# EAGLE design Sensor_Cameralink (EAGLE 9.6.2)
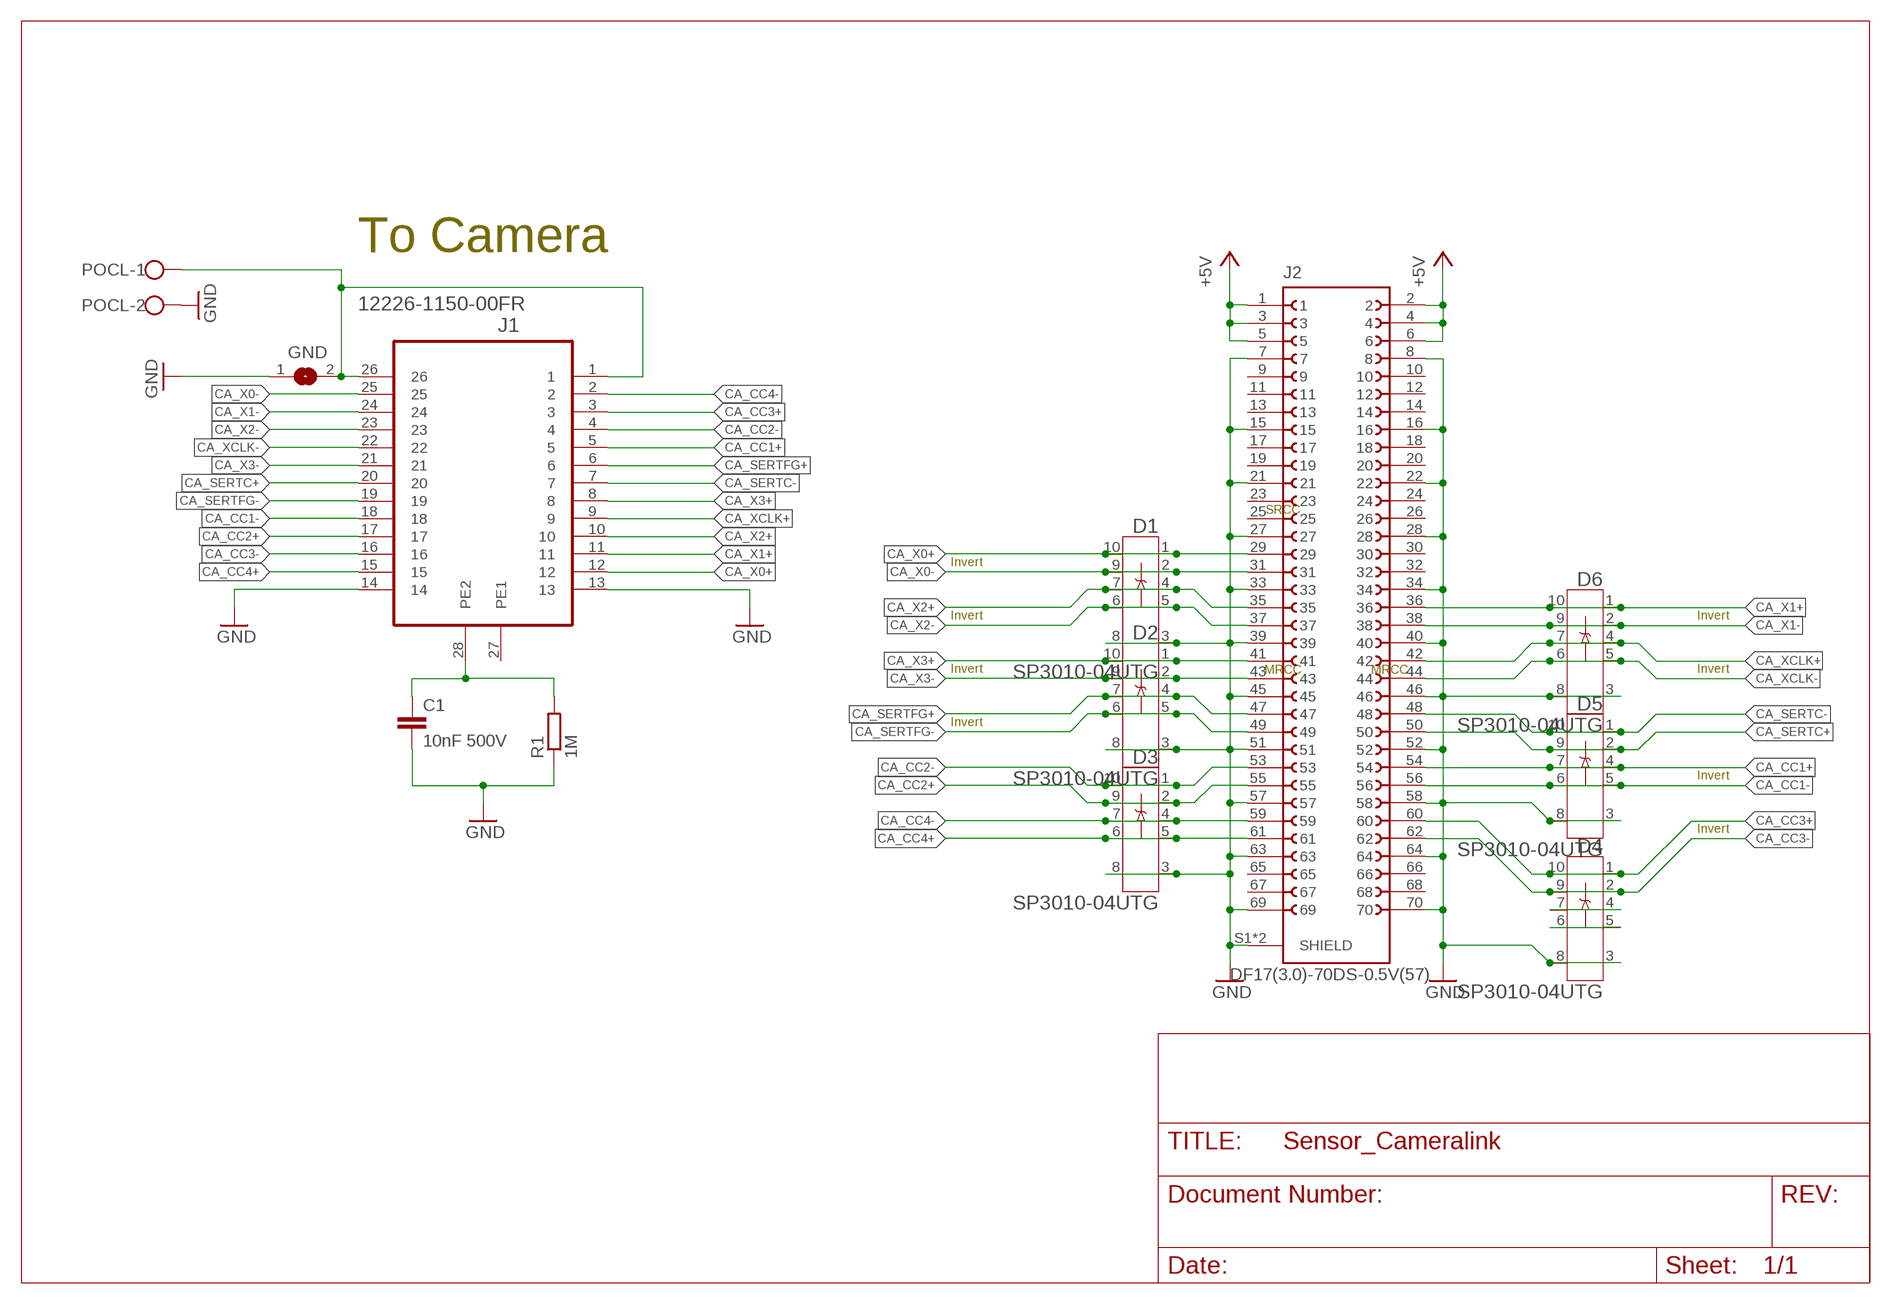
[diagram p0: schematic, sheet 1]

## Parts
C1  10nF 500V  C-EUC0805  [C0805]
D1  SP3010-04UTG  [UDFEN-10_MO229_LTF]
D2  SP3010-04UTG  [UDFEN-10_MO229_LTF]
D3  SP3010-04UTG  [UDFEN-10_MO229_LTF]
D4  SP3010-04UTG  [UDFEN-10_MO229_LTF]
D5  SP3010-04UTG  [UDFEN-10_MO229_LTF]
D6  SP3010-04UTG  [UDFEN-10_MO229_LTF]
GND  SJ  [SJ]
J1  12226-1150-00FR  [3M_12226-1150-00FR]
J2  DF17(3.0)-70DS-0.5V(57)  [DF17(3.0)-70DS-0.5V(57)]
POCL  W237-102  [W237-102]
R1  1M  R-EU_R0805  [R0805]

## Nets
+5V: J2.1 J2.2 J2.3 J2.4 J2.5 J2.6
CA_CC1+: D5.4 D5.7 J1.5 J2.54
CA_CC1-: D5.5 D5.6 J1.18 J2.56
CA_CC2+: D3.2 D3.9 J1.17 J2.55
CA_CC2-: D3.1 D3.10 J1.4 J2.53
CA_CC3+: D4.1 D4.10 J1.3 J2.60
CA_CC3-: D4.2 D4.9 J1.16 J2.62
CA_CC4+: D3.5 D3.6 J1.15 J2.61
CA_CC4-: D3.4 D3.7 J1.2 J2.59
CA_SERTC+: D5.2 D5.9 J1.20 J2.50
CA_SERTC-: D5.1 D5.10 J1.7 J2.48
CA_SERTFG+: D2.4 D2.7 J1.6 J2.47
CA_SERTFG-: D2.5 D2.6 J1.19 J2.49
CA_X0+: D1.1 D1.10 J1.12 J2.29
CA_X0-: D1.2 D1.9 J1.25 J2.31
CA_X1+: D6.1 D6.10 J1.11 J2.36
CA_X1-: D6.2 D6.9 J1.24 J2.38
CA_X2+: D1.4 D1.7 J1.10 J2.35
CA_X2-: D1.5 D1.6 J1.23 J2.37
CA_X3+: D2.1 D2.10 J1.8 J2.41
CA_X3-: D2.2 D2.9 J1.21 J2.43
CA_XCLK+: D6.4 D6.7 J1.9 J2.42
CA_XCLK-: D6.5 D6.6 J1.22 J2.44
GND: C1.2 D1.3 D1.8 D2.3 D2.8 D3.3 D3.8 D4.3 D4.8 D5.3 D5.8 D6.3 D6.8 GND.1 J1.13 J1.14 J2.7 J2.8 J2.15 J2.16 J2.21 J2.22 J2.27 J2.28 J2.33 J2.34 J2.39 J2.40 J2.45 J2.46 J2.51 J2.52 J2.57 J2.58 J2.63 J2.64 J2.69 J2.70 J2.S1(SHIELD) J2.S2(SHIELD) POCL.2 R1.1
N$00001: D4.4 D4.7
N$00002: D4.5 D4.6
N$00005: C1.1 J1.28(PE2) R1.2
N$00011: GND.2 J1.1 J1.26 POCL.1
Unconnected: J1.27(PE1) J2.9 J2.10 J2.11 J2.12 J2.13 J2.14 J2.17 J2.18 J2.19 J2.20 J2.23 J2.24 J2.25 J2.26 J2.30 J2.32 J2.65 J2.66 J2.67 J2.68

## Notes on the sheet
- To Camera
- SRCC
- Invert
- Invert | Invert
- Invert | MRCC | MRCC | Invert
- Invert
- Invert
- Invert

## Library data of the parts
C1 = rcl:C-EU: CAPACITOR, European symbol; BUERKLIN: 56D510; LAGERORT: 67/01; MBM: 1; PREIS: 0,13
D1-D6 = onsemi:SP3010-04UTG; LCSC: C126837; MANUFACTURER_NAME: Littelfuse Inc; MPN: SP3010-04UTG
GND = jumper:SJ: SMD solder JUMPER
J1 = mh_fpga_anschlussplatine_v2:12226-1150-00FR: CONN SDR 26POS VERT RECEPT; FARNELL: 1321037; MBM: 1; PREIS: 10,08
J2 = Hirose:DF17(3.0)-70DS-0.5V(57)
POCL = con-wago-500:W237-102: WAGO SCREW CLAMP; MPN: 237-102; OC_FARNELL: unknown; OC_NEWARK: 70K9898
R1 = resistor:R-EU_: RESISTOR, European symbol; BUERKLIN: 11E338; MBM: 10; PREIS: 0,04

## Board
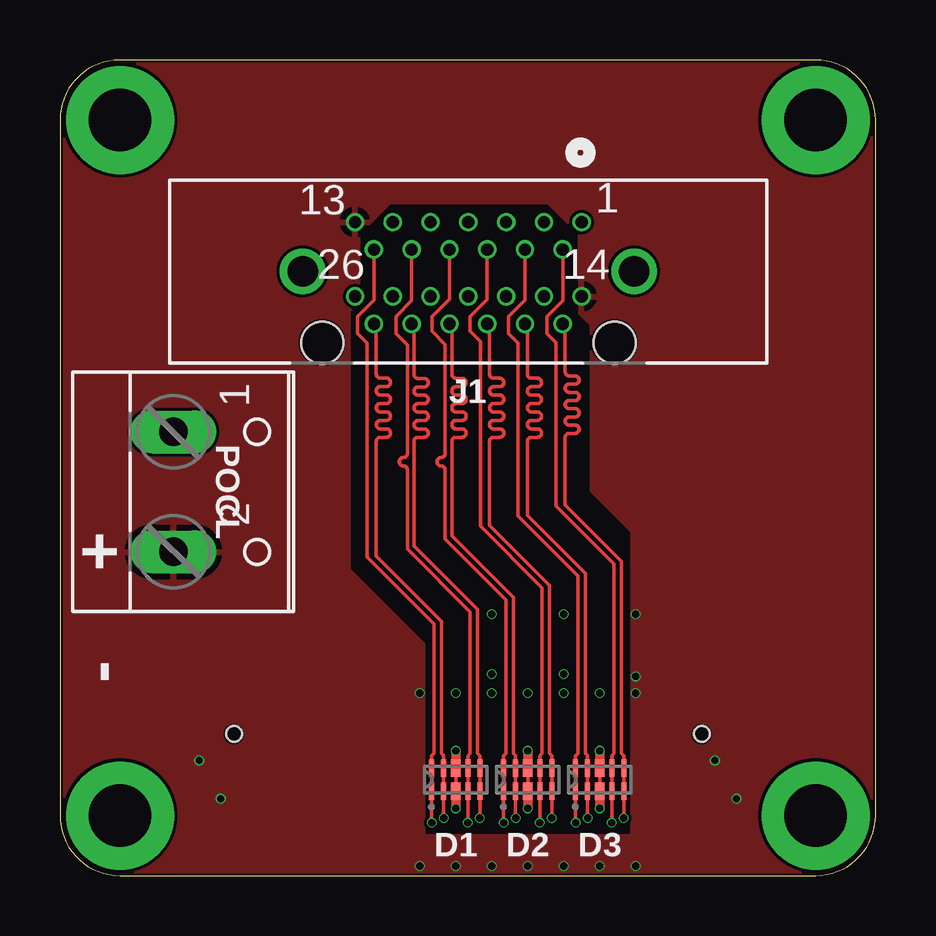
[diagram p1: board, top side]
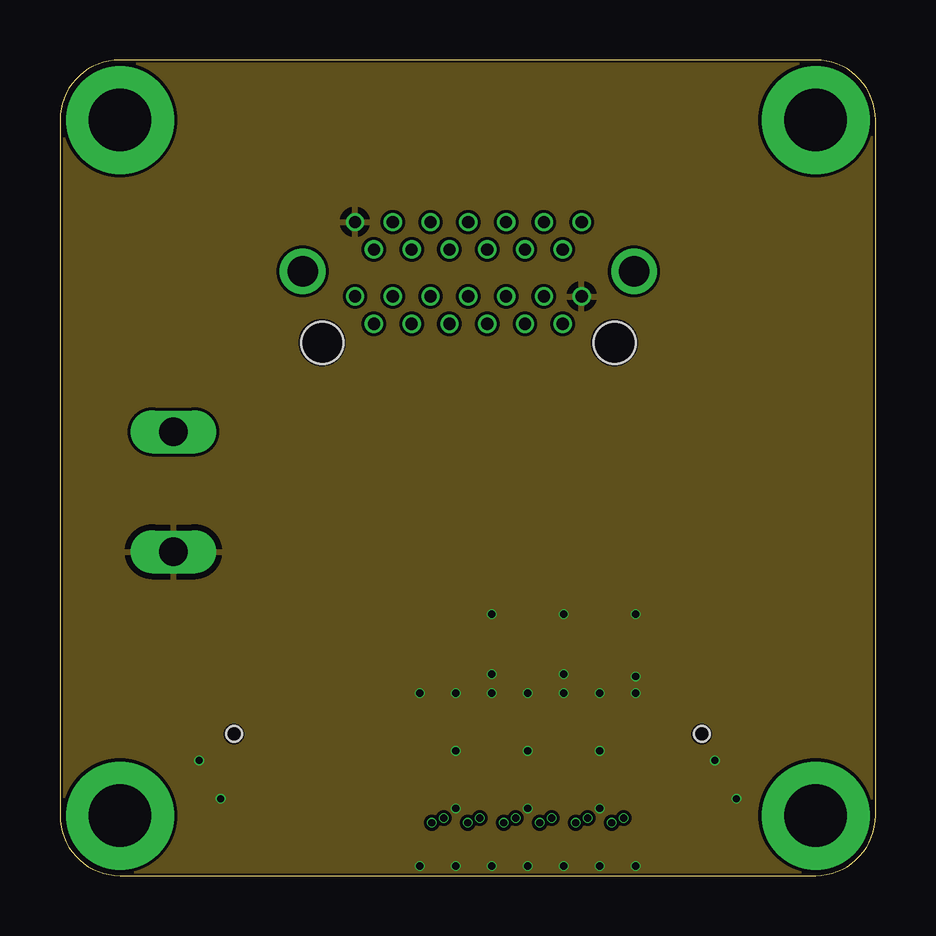
[diagram p2: board, inner layer Route2]
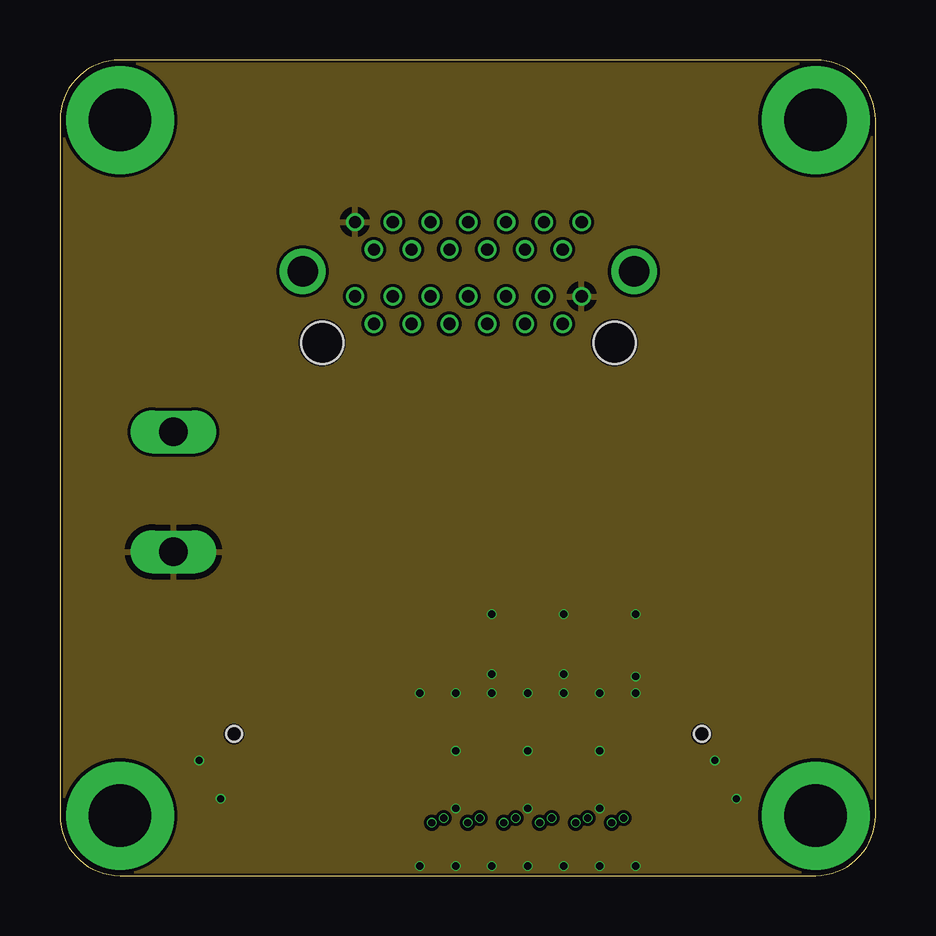
[diagram p3: board, inner layer Route15]
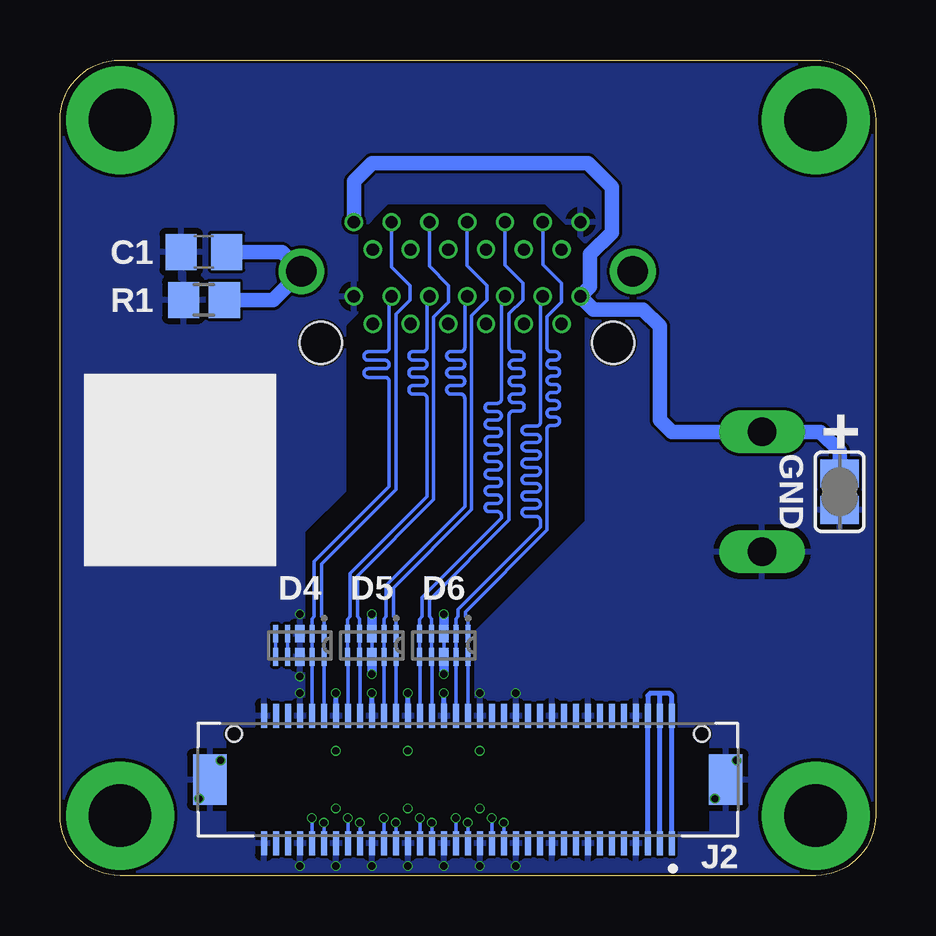
[diagram p4: board, bottom side, seen from below]

Size 34 x 34 mm. Coordinates in mm from the lower left corner, seen from the top.
Outline: 0,31.5 0,2.5 arc90 2.5,0 31.5,0 arc90 34,2.5 34,31.5 arc90 31.5,34 2.5,34 arc90 0,31.5
Copper layers (1*2*15*16): Top 0.035559375mm / dielectric 0.17018125mm / Route2 0.01778125mm / dielectric 47mil / Route15 0.01778125mm / dielectric 0.17018125mm / Bottom 0.035559375mm
Design rules "jlcpcb-4-layer *": minimum track width 5mil, minimum drill 0.2mm, track to track 5mil, track to pad 5mil, pad to pad 5mil, via to via 5mil, smd to smd 0mil, copper to edge 0.1mm, drill to drill 5mil, minimum pad ring 0.1mm, minimum via ring 0.05mm, stop-mask expansion 3mil, vias tented up to drill 100mil, thermal gap 10mil

### Footprints (pad centres in the part's own frame; a part is rotated, then mirrored left to right if it is on the bottom)
C0805 = smd 1.3 x 1.5: 1 -0.95,0; 2 0.95,0
UDFEN-10_MO229_LTF = smd 0.737 x 0.203: 1 -0.483,1.016; 2 -0.483,0.508; 4 -0.483,-0.508; 5 -0.483,-1.016; 6 0.483,-1.016; 7 0.483,-0.508; 9 0.483,0.508; 10 0.483,1.016 | smd 0.737 x 0.406: 3 -0.483,0; 8 0.483,0
SJ = smd 1.168 x 1.6: 1 -0.762,0; 2 0.762,0
3M_12226-1150-00FR = drill 0.508: 1 9.449,4.242; 2 8.661,3.099; 3 7.874,4.242; 4 7.087,3.099; 5 6.299,4.242; 6 5.512,3.099; 7 4.724,4.242; 8 3.937,3.099; 9 3.15,4.242; 10 2.362,3.099; 11 1.575,4.242; 12 0.787,3.099; 13 0,4.242; 14 9.449,1.143; 15 8.661,0; 16 7.874,1.143; 17 7.087,0; 18 6.299,1.143; 19 5.512,0; 20 4.724,1.143; 21 3.937,0; 22 3.15,1.143; 23 2.362,0; 24 1.575,1.143; 25 0.787,0; 26 0,1.143 | drill 1.27: 27 -2.184,2.184; 28 11.633,2.184 | hole 1.753: -1.372,-0.787; 10.82,-0.787
DF17(3.0)-70DS-0.5V(57) = smd 0.25 x 1: 1 -8.5,2.65; 2 -8.5,-2.65; 3 -8,2.65; 4 -8,-2.65; 5 -7.5,2.65; 6 -7.5,-2.65; 7 -7,2.65; 8 -7,-2.65; 9 -6.5,2.65; 10 -6.5,-2.65; 11 -6,2.65; 12 -6,-2.65; 13 -5.5,2.65; 14 -5.5,-2.65; 15 -5,2.65; 16 -5,-2.65; 17 -4.5,2.65; 18 -4.5,-2.65; 19 -4,2.65; 20 -4,-2.65; 21 -3.5,2.65; 22 -3.5,-2.65; 23 -3,2.65; 24 -3,-2.65; 25 -2.5,2.65; 26 -2.5,-2.65; 27 -2,2.65; 28 -2,-2.65; 29 -1.5,2.65; 30 -1.5,-2.65; 31 -1,2.65; 32 -1,-2.65; 33 -0.5,2.65; 34 -0.5,-2.65; 35 0,2.65; 36 0,-2.65; 37 0.5,2.65; 38 0.5,-2.65; 39 1,2.65; 40 1,-2.65; 41 1.5,2.65; 42 1.5,-2.65; 43 2,2.65; 44 2,-2.65; 45 2.5,2.65; 46 2.5,-2.65; 47 3,2.65; 48 3,-2.65; 49 3.5,2.65; 50 3.5,-2.65; 51 4,2.65; 52 4,-2.65; 53 4.5,2.65; 54 4.5,-2.65; 55 5,2.65; 56 5,-2.65; 57 5.5,2.65; 58 5.5,-2.65; 59 6,2.65; 60 6,-2.65; 61 6.5,2.65; 62 6.5,-2.65; 63 7,2.65; 64 7,-2.65; 65 7.5,2.65; 66 7.5,-2.65; 67 8,2.65; 68 8,-2.65; 69 8.5,2.65; 70 8.5,-2.65 | smd 1.4 x 2.1: S1 -10.75,0; S2 10.75,0 | hole 0.65: -9.75,-1.9; 9.75,-1.9
W237-102 = drill 1.194 long: 1 -2.5,-1.27; 2 2.5,-1.27
R0805 = smd 1.3 x 1.5: 1 -0.85,0; 2 0.85,0

### Placement (x,y rotation side)
C1  28,26 180 bottom
D1  16.5,4 90 top
D2  19.5,4 90 top
D3  22.5,4 90 top
D4  24,9.6 270 bottom
D5  21,9.6 270 bottom
D6  18,9.6 270 bottom
GND  1.5,16 90 bottom
J1  12.3,23 0 top
J2  17,4 180 bottom
POCL  6,16 270 top
R1  28,24 0 bottom

### Tracks (layer width: path | path; a pad name or v marks a point on that pad's centre or on a via)
+5V
  Bottom 0.2: J2.1 J2.2 8.5,7.5 8.6,7.6 9,7.6 | J2.3 J2.4 9,7.6 | J2.5 J2.6 9.5,7.5 9.4,7.6 9,7.6
CA_CC1+
  Bottom 0.15: J1.5 18.6,25.4 17.8,24.6 17.8,23.9 18.42,23.28 18.42,15.68 21.6,12.5 21.6,10.8 21.51,10.71 D5.4 | J2.54 D5.7
  Bottom 0.152: D5.4 D5.7
CA_CC1-
  Bottom 0.15: J1.18 18.7,24.04 18.7,22.01 arc90 18.87,21.84 19.28,21.84 arc-90 19.45,21.67 19.45,21.66 arc-90 19.28,21.49 18.87,21.49 arc90 18.7,21.32 18.7,21.3 arc90 18.87,21.13 19.28,21.13 arc-90 19.45,20.96 19.45,20.95 arc-90 19.28,20.78 18.87,20.78 arc90 18.7,20.61 18.7,20.59 arc90 18.87,20.43 19.28,20.43 arc-90 19.45,20.25 19.45,20.24 arc-90 19.28,20.07 18.87,20.07 arc90 18.7,19.9 18.7,15.8 21.9,12.6 21.9,10.8 22.02,10.68 D5.5 | J2.56 22,9.1 D5.6
  Bottom 0.152: D5.5 D5.6
CA_CC2+  (via drill 0.3)
  Top 0.15: J1.17 19.49,22.9 19.49,20.9 arc90 19.66,20.73 19.91,20.73 arc-90 20.08,20.56 20.08,20.55 arc-90 19.91,20.38 19.66,20.38 arc90 19.49,20.21 19.49,20.2 arc90 19.66,20.03 19.91,20.03 arc-90 20.08,19.86 20.08,19.85 arc-90 19.91,19.68 19.66,19.68 arc90 19.49,19.51 19.49,19.5 arc90 19.66,19.32 19.91,19.32 arc-90 20.08,19.15 20.08,19.14 arc-90 19.91,18.97 19.66,18.97 arc90 19.49,18.8 19.49,18.79 arc90 19.66,18.62 19.91,18.62 arc-90 20.08,18.45 20.08,18.44 arc-90 19.91,18.27 19.66,18.27 arc90 19.49,18.1 19.49,15.01 21.9,12.6 21.9,5.1 21.99,5.01 D3.9 | D3.2 v21.99,2.41 v22,2.4
  Top 0.152: D3.2 D3.9
  Bottom 0.15: J2.55 v22,2.4
CA_CC2-  (via drill 0.3)
  Top 0.15: J1.4 19.39,23.99 18.7,23.3 18.7,22.6 19.1,22.2 19.1,15 21.6,12.5 21.6,5.1 21.48,4.98 D3.10 | D3.1 21.48,2.22 v21.5,2.2
  Top 0.152: D3.1 D3.10
  Bottom 0.15: J2.53 v21.5,2.2
CA_CC3+
  Bottom 0.15: J1.3 20.17,25.37 19.4,24.6 19.4,24 20,23.4 20,16.1 23.1,13 23.1,10.8 22.98,10.68 D4.1 | J2.60 23,9.1 D4.10
  Bottom 0.152: D4.1 D4.10
CA_CC3-
  Bottom 0.15: J1.16 20.27,24.04 20.27,22.01 arc90 20.44,21.84 21.15,21.84 arc-90 21.32,21.66 21.32,21.65 arc-90 21.15,21.48 20.44,21.48 arc90 20.27,21.31 20.27,21.3 arc90 20.44,21.12 21.15,21.12 arc-90 21.32,20.95 21.32,20.94 arc-90 21.15,20.77 20.44,20.77 arc90 20.27,20.6 20.27,16.23 23.4,13.1 23.4,10.8 23.49,10.71 D4.2 | J2.62 D4.9
  Bottom 0.152: D4.2 D4.9
CA_CC4+  (via drill 0.3)
  Top 0.15: J1.15 21.06,22.9 21.06,21 arc90 21.23,20.83 21.48,20.83 arc-90 21.65,20.66 21.65,20.66 arc-90 21.48,20.49 21.23,20.49 arc90 21.06,20.32 21.06,20.32 arc90 21.23,20.15 21.48,20.15 arc-90 21.65,19.98 21.65,19.97 arc-90 21.48,19.8 21.23,19.8 arc90 21.06,19.63 21.06,19.63 arc90 21.23,19.46 21.48,19.46 arc-90 21.65,19.29 21.65,19.29 arc-90 21.48,19.12 21.23,19.12 arc90 21.06,18.95 21.06,18.95 arc90 21.23,18.78 21.48,18.78 arc-90 21.65,18.61 21.65,18.61 arc-90 21.48,18.43 21.23,18.43 arc90 21.06,18.27 21.06,15.44 23.4,13.1 23.4,5.1 23.52,4.98 D3.6 | D3.5 23.52,2.42 v23.5,2.4
  Top 0.152: D3.5 D3.6
  Bottom 0.15: J2.61 v23.5,2.4
CA_CC4-  (via drill 0.3)
  Top 0.15: J1.2 20.96,23.96 20.3,23.3 20.3,22.6 20.68,22.22 20.68,15.42 23.1,13 23.1,5.1 23,5 D3.7 | D3.4 v23.01,2.21 v23,2.2
  Top 0.152: D3.4 D3.7
  Bottom 0.15: J2.59 v23,2.2
CA_SERTC+
  Bottom 0.15: J1.20 17.12,24.04 17.12,22.01 arc90 17.3,21.84 17.71,21.84 arc-90 17.88,21.67 17.88,21.66 arc-90 17.71,21.49 17.3,21.49 arc90 17.12,21.32 17.12,21.3 arc90 17.3,21.13 17.71,21.13 arc-90 17.88,20.96 17.88,20.95 arc-90 17.71,20.78 17.3,20.78 arc90 17.12,20.61 17.12,20.59 arc90 17.3,20.43 17.71,20.43 arc-90 17.88,20.25 17.88,20.24 arc-90 17.71,20.07 17.3,20.07 arc90 17.12,19.9 17.12,15.38 20.4,12.1 20.4,10.8 20.49,10.71 D5.2 | J2.50 D5.9
  Bottom 0.152: D5.2 D5.9
CA_SERTC-
  Bottom 0.15: J1.7 17.02,25.42 16.2,24.6 16.2,24 16.85,23.35 16.85,15.25 20.1,12 20.1,10.8 19.98,10.68 D5.1 | J2.48 20,9.1 D5.10
  Bottom 0.152: D5.1 D5.10
CA_SERTFG+  (via drill 0.3)
  Top 0.15: J1.6 17.81,24.01 17.1,23.3 17.1,22.7 17.54,22.27 17.54,14.56 20.1,12 20.1,5.1 20,5 D2.7 | D2.4 v20.01,2.21 v20,2.2
  Top 0.152: D2.4 D2.7
  Bottom 0.15: J2.47 v20,2.2
CA_SERTFG-  (via drill 0.3)
  Top 0.15: J1.19 17.91,22.9 17.91,20.9 arc90 18.08,20.73 18.33,20.73 arc-90 18.5,20.56 18.5,20.55 arc-90 18.33,20.38 18.08,20.38 arc90 17.91,20.21 17.91,20.2 arc90 18.08,20.03 18.33,20.03 arc-90 18.5,19.86 18.5,19.85 arc-90 18.33,19.68 18.08,19.68 arc90 17.91,19.51 17.91,19.5 arc90 18.08,19.32 18.33,19.32 arc-90 18.5,19.15 18.5,19.14 arc-90 18.33,18.97 18.08,18.97 arc90 17.91,18.8 17.91,18.79 arc90 18.08,18.62 18.33,18.62 arc-90 18.5,18.45 18.5,18.44 arc-90 18.33,18.27 18.08,18.27 arc90 17.91,18.1 17.91,14.59 20.4,12.1 20.4,5.1 20.52,4.98 D2.6 | D2.5 20.52,2.42 v20.5,2.4
  Top 0.152: D2.6 D2.5
  Bottom 0.15: J2.49 v20.5,2.4
CA_X0+  (via drill 0.3)
  Top 0.15: J1.12 13.09,23.99 12.4,23.3 12.4,22.6 12.81,22.19 12.81,13.29 15.6,10.5 15.6,5.1 15.48,4.98 D1.10 | D1.1 15.48,2.22 v15.5,2.2
  Top 0.152: D1.1 D1.10
  Bottom 0.15: J2.29 v15.5,2.2
CA_X0-  (via drill 0.3)
  Top 0.15: J1.25 13.19,22.9 13.19,20.91 arc90 13.36,20.74 13.61,20.74 arc-90 13.78,20.57 13.78,20.55 arc-90 13.61,20.38 13.36,20.38 arc90 13.19,20.21 13.19,20.2 arc90 13.36,20.03 13.61,20.03 arc-90 13.78,19.86 13.78,19.85 arc-90 13.61,19.68 13.36,19.68 arc90 13.19,19.51 13.19,19.5 arc90 13.36,19.33 13.61,19.33 arc-90 13.78,19.16 13.78,19.14 arc-90 13.61,18.98 13.36,18.98 arc90 13.19,18.8 13.19,18.79 arc90 13.36,18.62 13.61,18.62 arc-90 13.78,18.45 13.78,18.44 arc-90 13.61,18.27 13.36,18.27 arc90 13.19,18.1 13.19,13.31 15.9,10.6 15.9,5.1 15.99,5.01 D1.9 | D1.2 v15.99,2.41 v16,2.4
  Top 0.152: D1.2 D1.9
  Bottom 0.15: J2.31 v16,2.4
CA_X1+
  Bottom 0.15: J1.11 13.88,25.48 13.1,24.7 13.1,23.9 13.7,23.3 13.7,22.01 arc-90 13.53,21.84 13.34,21.84 arc90 13.17,21.66 | 13.17,21.66 | 13.17,21.66 arc90 13.34,21.5 13.53,21.5 arc-90 13.7,21.32 | 13.7,21.32 | 13.7,21.32 arc-90 13.53,21.16 13.34,21.16 arc90 13.17,20.98 | 13.17,20.98 | 13.17,20.98 arc90 13.34,20.81 13.53,20.81 arc-90 13.7,20.64 | 13.7,20.64 | 13.7,20.64 arc-90 13.53,20.47 13.34,20.47 arc90 13.17,20.3 | 13.17,20.3 | 13.17,20.3 arc90 13.34,20.13 13.53,20.13 arc-90 13.7,19.96 | 13.7,19.96 | 13.7,19.96 arc-90 13.53,19.79 13.34,19.79 arc90 13.17,19.62 | 13.17,19.62 | 13.17,19.62 arc90 13.34,19.45 13.53,19.45 arc-90 13.7,19.28 | 13.7,19.28 | 13.7,19.28 arc-90 13.53,19.11 13.34,19.11 arc90 13.17,18.94 13.17,18.94 arc90 13.34,18.77 13.53,18.77 arc-90 13.7,18.6 13.7,14.4 17.1,11 17.1,10.8 16.98,10.68 D6.1 | D6.10 17,9.1 J2.36
  Bottom 0.152: D6.1 D6.10
CA_X1-
  Bottom 0.15: J1.24 13.97,24.04 13.97,18.9 arc90 14.14,18.73 14.57,18.73 arc-90 14.74,18.56 14.74,18.56 arc-90 14.57,18.39 14.14,18.39 arc90 13.97,18.22 13.97,18.22 arc90 14.14,18.05 14.57,18.05 arc-90 14.74,17.88 14.74,17.87 arc-90 14.57,17.7 14.14,17.7 arc90 13.97,17.53 13.97,17.53 arc90 14.14,17.36 14.57,17.36 arc-90 14.74,17.19 14.74,17.19 arc-90 14.57,17.02 14.14,17.02 arc90 13.97,16.85 13.97,16.85 arc90 14.14,16.68 14.57,16.68 arc-90 14.74,16.51 14.74,16.51 arc-90 14.57,16.34 14.14,16.34 arc90 13.97,16.17 13.97,16.16 arc90 14.14,16 14.57,16 arc-90 14.74,15.82 14.74,15.82 arc-90 14.57,15.65 14.14,15.65 arc90 13.97,15.48 13.97,15.48 arc90 14.14,15.31 14.57,15.31 arc-90 14.74,15.14 14.74,15.14 arc-90 14.57,14.97 14.14,14.97 arc90 13.97,14.8 13.97,14.53 17.4,11.1 17.4,10.8 17.49,10.71 D6.2 | J2.38 D6.9
  Bottom 0.152: D6.2 D6.9
CA_X2+  (via drill 0.3)
  Top 0.15: J1.10 14.66,23.96 14,23.3 14,22.6 14.48,22.12 14.48,17.6 arc-90 14.31,17.43 arc90 14.14,17.26 14.14,17.25 arc90 14.31,17.08 arc-90 14.48,16.91 14.48,13.62 17.1,11 17.1,5.1 17,5 D1.7 | D1.4 v17.01,2.21 v17,2.2
  Top 0.152: D1.4 D1.7
  Bottom 0.15: J2.35 v17,2.2
CA_X2-  (via drill 0.3)
  Top 0.15: J1.23 14.76,22.9 14.76,20.89 arc90 14.93,20.72 15.19,20.72 arc-90 15.36,20.55 15.36,20.54 arc-90 15.19,20.37 14.93,20.37 arc90 14.76,20.2 14.76,20.19 arc90 14.93,20.02 15.19,20.02 arc-90 15.36,19.85 15.36,19.84 arc-90 15.19,19.67 14.93,19.67 arc90 14.76,19.5 14.76,19.49 arc90 14.93,19.32 15.19,19.32 arc-90 15.36,19.15 15.36,19.14 arc-90 15.19,18.97 14.93,18.97 arc90 14.76,18.8 14.76,18.79 arc90 14.93,18.62 15.19,18.62 arc-90 15.36,18.45 15.36,18.44 arc-90 15.19,18.27 14.93,18.27 arc90 14.76,18.1 14.76,13.74 17.4,11.1 17.4,5.1 17.52,4.98 D1.6 | D1.5 17.52,2.42 v17.5,2.4
  Top 0.152: D1.5 D1.6
  Bottom 0.15: J2.37 v17.5,2.4
CA_X3+  (via drill 0.3)
  Top 0.15: J1.8 16.24,24.04 15.5,23.3 15.5,22.7 16.06,22.14 16.06,17.6 arc-90 15.89,17.43 arc90 15.72,17.26 15.72,17.24 arc90 15.89,17.07 arc-90 16.06,16.9 16.06,14.04 18.6,11.5 18.6,5.1 18.48,4.98 D2.10 | D2.1 18.48,2.22 v18.5,2.2
  Top 0.152: D2.1 D2.10
  Bottom 0.15: J2.41 v18.5,2.2
CA_X3-  (via drill 0.3)
  Top 0.15: J1.21 16.34,22.9 16.34,20.9 arc90 16.51,20.73 16.76,20.73 arc-90 16.93,20.56 16.93,20.55 arc-90 16.76,20.38 16.51,20.38 arc90 16.34,20.21 16.34,20.2 arc90 16.51,20.03 16.76,20.03 arc-90 16.93,19.86 16.93,19.85 arc-90 16.76,19.68 16.51,19.68 arc90 16.34,19.5 16.34,19.49 arc90 16.51,19.32 16.76,19.32 arc-90 16.93,19.15 16.93,19.14 arc-90 16.76,18.97 16.51,18.97 arc90 16.34,18.8 16.34,18.79 arc90 16.51,18.62 16.76,18.62 arc-90 16.93,18.45 16.93,18.44 arc-90 16.76,18.27 16.51,18.27 arc90 16.34,18.1 16.34,14.16 18.9,11.6 18.9,5.1 18.99,5.01 D2.9 | D2.2 v18.99,2.41 v19,2.4
  Top 0.152: D2.2 D2.9
  Bottom 0.15: J2.43 v19,2.4
CA_XCLK+
  Bottom 0.15: J1.9 15.45,25.45 14.7,24.7 14.7,24 15.27,23.43 15.27,22 arc-90 15.1,21.83 14.82,21.83 arc90 14.65,21.66 14.65,21.65 arc90 14.82,21.48 15.1,21.48 arc-90 15.27,21.31 15.27,21.3 arc-90 15.1,21.13 14.82,21.13 arc90 14.65,20.96 14.65,20.95 arc90 14.82,20.78 15.1,20.78 arc-90 15.27,20.61 15.27,20.6 arc-90 15.1,20.43 14.82,20.43 arc90 14.65,20.26 14.65,20.24 arc90 14.82,20.07 15.1,20.07 arc-90 15.27,19.9 15.27,19.89 arc-90 15.1,19.72 14.82,19.72 arc90 14.65,19.55 14.65,19.54 arc90 14.82,19.37 15.1,19.37 arc-90 15.27,19.2 15.27,14.83 18.6,11.5 18.6,10.8 18.51,10.71 D6.4 | J2.42 D6.7
  Bottom 0.152: D6.4 D6.7
CA_XCLK-
  Bottom 0.15: J1.22 15.6,23.99 15.6,19.86 arc90 15.77,19.69 16.11,19.69 arc-90 16.28,19.52 16.28,19.51 arc-90 16.11,19.34 15.77,19.34 arc90 15.6,19.17 15.6,19.16 arc90 15.77,18.99 16.11,18.99 arc-90 16.28,18.82 16.28,18.81 arc-90 16.11,18.64 15.77,18.64 arc90 15.6,18.47 15.6,18.47 arc90 15.77,18.3 16.11,18.3 arc-90 16.28,18.13 16.28,18.12 arc-90 16.11,17.95 15.77,17.95 arc90 15.6,17.78 15.6,17.77 arc90 15.77,17.6 16.11,17.6 arc-90 16.28,17.43 16.28,17.43 arc-90 16.11,17.25 15.77,17.25 arc90 15.6,17.08 15.6,17.08 arc90 15.77,16.91 16.11,16.91 arc-90 16.28,16.74 16.28,16.73 arc-90 16.11,16.56 15.77,16.56 arc90 15.6,16.39 15.6,16.38 arc90 15.77,16.21 16.11,16.21 arc-90 16.28,16.04 16.28,16.04 arc-90 16.11,15.87 15.77,15.87 arc90 15.6,15.7 15.6,15.69 arc90 15.77,15.52 16.11,15.52 arc-90 16.28,15.35 16.28,15.34 arc-90 16.11,15.17 15.77,15.17 arc90 15.6,15 15.6,14.9 18.9,11.6 18.9,10.8 19.02,10.68 D6.5 | J2.44 19,9.1 D6.6
  Bottom 0.152: D6.5 D6.6
GND  (via drill 0.3)
  Top 0.152: D1.3 D1.8 | D2.3 D2.8 | D3.3 D3.8
  Top 0.4: D3.3 v22.5,2.8 | D2.3 v19.5,2.8 | D1.3 v16.5,2.8 | D3.8 v22.5,5.2 | D2.8 v19.5,5.2 | D1.8 v16.5,5.2
  Bottom 0.152: D6.3 D6.8 | D5.3 D5.8
  Bottom 0.2: J2.40 v18,7.6 | J2.46 v19.5,7.6 | J2.52 v21,7.6 | J2.58 v22.5,7.6
  Bottom 0.4: D6.3 v18,10.9 | D5.3 v21,10.9 | v21,8.4 D5.8 | v18,8.4 D6.8
  other vias: 24,7.6 16.5,7.6 15,0.4 16.5,0.4 18,0.4 19.5,0.4 21,0.4 22.5,0.4 24,0.4 5.8,4.8 6.7,3.2 27.3,4.8 28.2,3.2 15,7.6 24,10.9 24,8.3
  pour Top: 0,0 34,0 34,34 0,34
  pour Bottom: 0,0 34,0 34,34 0,34
  pour Route15: 0,0 34,0 34,34 0,34
  pour Route2: 0,0 34,0 34,34 0,34
  cutout Bottom: 21.5,23.4 21.5,26.7 20.3,27.9 13.8,27.9 12.2,26.3 12.2,14.8 16.8,10.2 16.8,7.3 23.7,7.3 23.7,14.3 22,16 22,22.9
  cutout Top: 15.3,1.8 23.7,1.8 23.7,14.3 22,16 22,22.9 21.5,23.4 21.5,26.7 20.3,27.9 13.8,27.9 12.6,26.7 12.6,23.9 12.2,23.5 12.2,12.8 15.3,9.7
N$00001
  Bottom 0.152: D4.4 D4.7
N$00002
  Bottom 0.152: D4.5 D4.6
N$00005
  Bottom 0.6: C1.1 24.75,26 J1.28 25.12,24 R1.2
N$00011
  Bottom 0.6: J1.1 21.75,28.95 21,29.7 12,29.7 11,28.7 11,26.8 11.9,25.9 11.9,24.54 J1.26 11.76,23.6 9.7,23.6 9,22.9 9,19 8.5,18.5 POCL.1 2.3,18.5 1.5,17.7 GND.2
N$00025  (via drill 2.6 pad 4.5)
  other vias: 2.5,31.5
N$00026  (via drill 2.6 pad 4.5)
  other vias: 31.5,31.5
N$00027  (via drill 2.6 pad 4.5)
  other vias: 2.5,2.5
N$00028  (via drill 2.6 pad 4.5)
  other vias: 31.5,2.5

### Text on the board
tNames: + | -
bNames: +
tStop: CAMERALINK